# EAGLE schematic button (EAGLE 6.5.0)
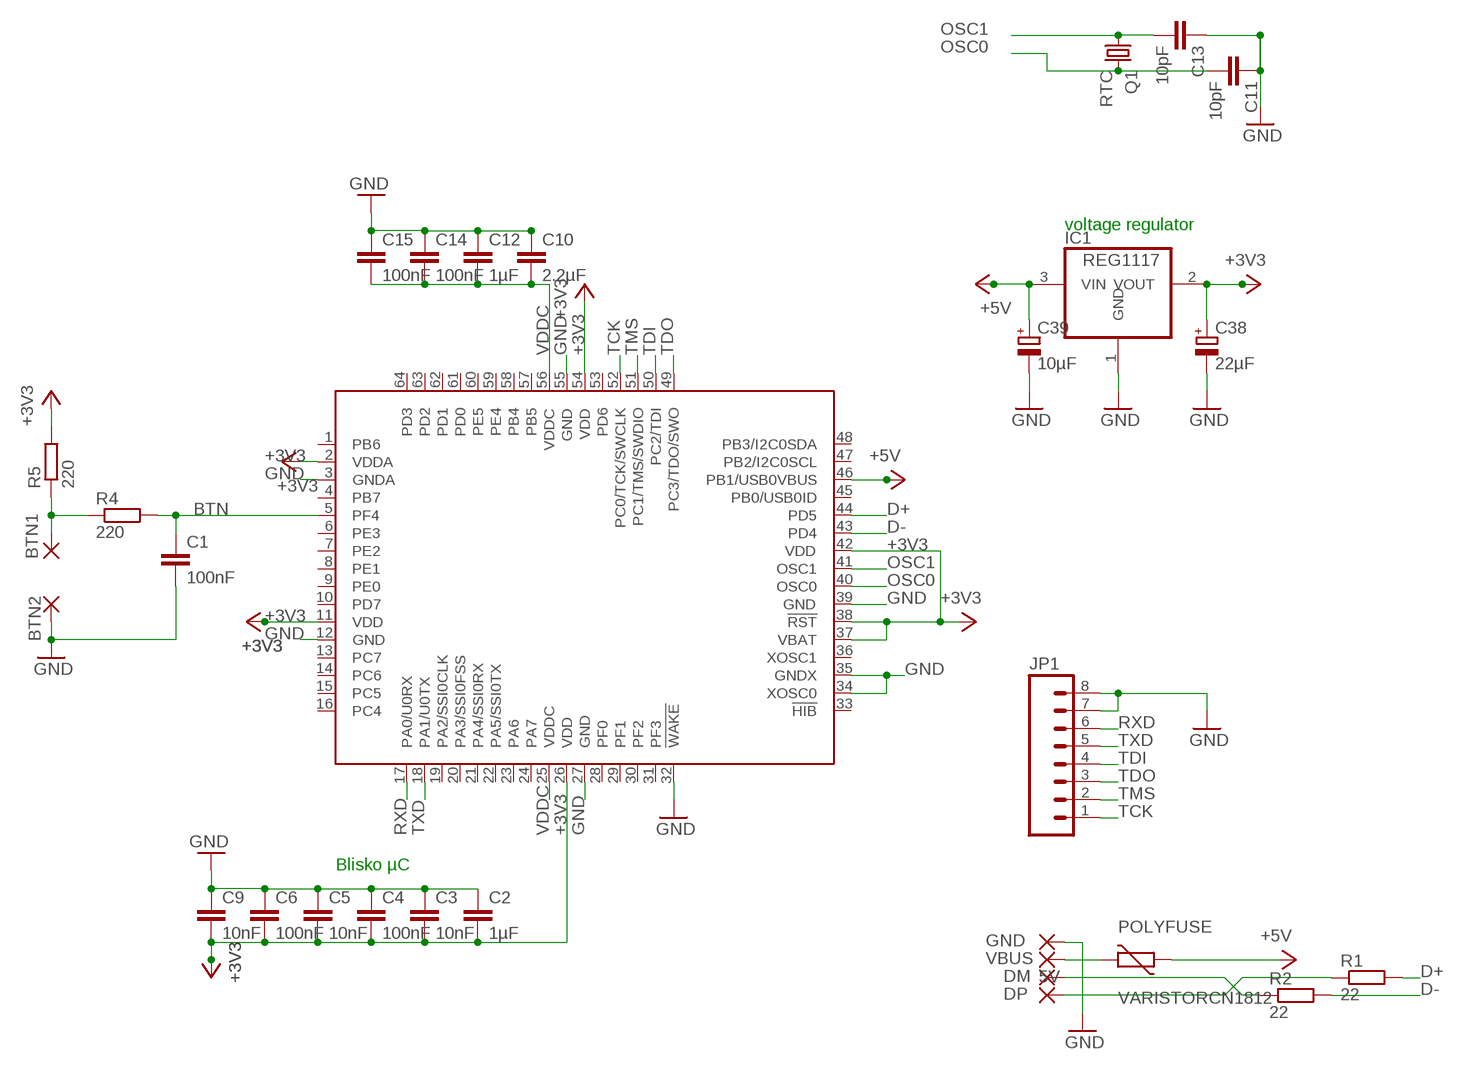
[diagram p0: schematic, sheet 1]

## Parts
BTN1  1,6/0,8  [1,6/0,8]
BTN2  1,6/0,8  [1,6/0,8]
C1  100nF  C-EUC0603  [C0603]
C2  1µF  C-EUC0603  [C0603]
C3  10nF  C-EUC0603  [C0603]
C4  100nF  C-EUC0603  [C0603]
C5  10nF  C-EUC0603  [C0603]
C6  100nF  C-EUC0603  [C0603]
C9  10nF  C-EUC0603  [C0603]
C10  2.2µF  C-EUC0603  [C0603]
C11  10pF  C-EUC0603  [C0603]
C12  1µF  C-EUC0603  [C0603]
C13  10pF  C-EUC0603  [C0603]
C14  100nF  C-EUC0603  [C0603]
C15  100nF  C-EUC0603  [C0603]
C38  22µF  CPOL-EUB/3528-21W  [B/3528-21W]
C39  10µF  CPOL-EUB/3528-21W  [B/3528-21W]
DM  1,6/0,8  [1,6/0,8]
DP  1,6/0,8  [1,6/0,8]
GND  1,6/0,8  [1,6/0,8]
IC1  REG1117  [SOT223]
IC2  TM4C123[7,G]XXPM  [PM_S-PQFP-G64]
JP1  M081X08  [1X08]
POLYFUSE  VARISTORCN1812  [CT/CN1812]
Q1  RTC  CRYSTALHC49S  [HC49/S]
R1  22  R-EU_R0805  [R0805]
R2  22  R-EU_R0805  [R0805]
R4  220  R-EU_R0603  [R0603]
R5  220  R-EU_R0603  [R0603]
VBUS  5V  1,6/0,8  [1,6/0,8]

## Nets
+3V3: C2.2 C3.2 C4.2 C5.2 C6.2 C9.2 C38.+ IC1.2(VOUT) IC2.2(VDDA) IC2.11(VDD) IC2.26(VDD) IC2.37(VBAT) IC2.38(!RST) IC2.42(VDD) IC2.54(VDD) R5.2
+5V: C39.+ IC1.3(VIN) IC2.46(PB1/USB0VBUS) POLYFUSE.1
BTN: C1.1 IC2.5(PF4) R4.2
D+: IC2.44(PD5) R1.2
D-: IC2.43(PD4) R2.2
GND: BTN2.1(P) C1.2 C2.1 C3.1 C4.1 C5.1 C6.1 C9.1 C10.1 C11.1 C12.1 C13.1 C14.1 C15.1 C38.- C39.- GND.1(P) IC1.1(GND) IC2.3(GNDA) IC2.12(GND) IC2.27(GND) IC2.32(!WAKE) IC2.34(XOSC0) IC2.35(GNDX) IC2.39(GND) IC2.55(GND) JP1.7 JP1.8
N$2: BTN1.1(P) R4.1 R5.1
N$6: DP.1(P) R1.1
N$7: DM.1(P) R2.1
N$10: POLYFUSE.2 VBUS.1(P)
OSC0: C11.2 IC2.40(OSC0) Q1.2
OSC1: C13.2 IC2.41(OSC1) Q1.1
RXD: IC2.17(PA0/U0RX) JP1.6
TCK: IC2.52(PC0/TCK/SWCLK) JP1.1
TDI: IC2.50(PC2/TDI) JP1.4
TDO: IC2.49(PC3/TDO/SWO) JP1.3
TMS: IC2.51(PC1/TMS/SWDIO) JP1.2
TXD: IC2.18(PA1/U0TX) JP1.5
VDDC: C10.2 C12.2 C14.2 C15.2 IC2.25(VDDC) IC2.56(VDDC)
Unconnected: IC2.1(PB6) IC2.4(PB7) IC2.6(PE3) IC2.7(PE2) IC2.8(PE1) IC2.9(PE0) IC2.10(PD7) IC2.13(PC7) IC2.14(PC6) IC2.15(PC5) IC2.16(PC4) IC2.19(PA2/SSI0CLK) IC2.20(PA3/SSI0FSS) IC2.21(PA4/SSI0RX) IC2.22(PA5/SSI0TX) IC2.23(PA6) IC2.24(PA7) IC2.28(PF0) IC2.29(PF1) IC2.30(PF2) IC2.31(PF3) IC2.33(!HIB) IC2.36(XOSC1) IC2.45(PB0/USB0ID) IC2.47(PB2/I2C0SCL) IC2.48(PB3/I2C0SDA) IC2.53(PD6) IC2.57(PB5) IC2.58(PB4) IC2.59(PE4) IC2.60(PE5) IC2.61(PD0) IC2.62(PD1) IC2.63(PD2) IC2.64(PD3)

## Notes on the sheet
- voltage regulator
- Blisko µC

## Library data of the parts
BTN1 BTN2 DM DP GND VBUS = wirepad:1,6/0,8: THROUGH-HOLE PAD
C1-C6 C9-C15 = rcl:C-EU: CAPACITOR, European symbol
C38 C39 = rcl:CPOL-EU: POLARIZED CAPACITOR, European symbol
IC1 = burr-brown:REG1117: 800mA and 1A Low Dropout (LDO) Positive Regulator 1.8V, 2.5V, 2.85V, 3.3V, 5V, and Adj; MPN: REG1117; OC_FARNELL: 1097566; OC_NEWARK: 14P6981
IC2 = ti-tiva:TM4C123[7,G]XX
JP1 = SparkFun-Connectors:M08: Header 8 Standard 8-pin 0.1" header. Use with straight break away headers (SKU : PRT-00116), right angle break away headers (PRT-00553), swiss pins (PRT-00743), machine pins (PRT-00117), and female headers (PRT-00115).
POLYFUSE = varistor:VARISTOR: VARISTOR
Q1 = crystal:CRYSTAL: CRYSTAL; OC_FARNELL: 1667008; OC_NEWARK: unknown
R1 R2 = resistor:R-EU_: RESISTOR, European symbol
R4 R5 = rcl:R-EU_: RESISTOR, European symbol